# EAGLE design template_50x45 (EAGLE 7.2.0)
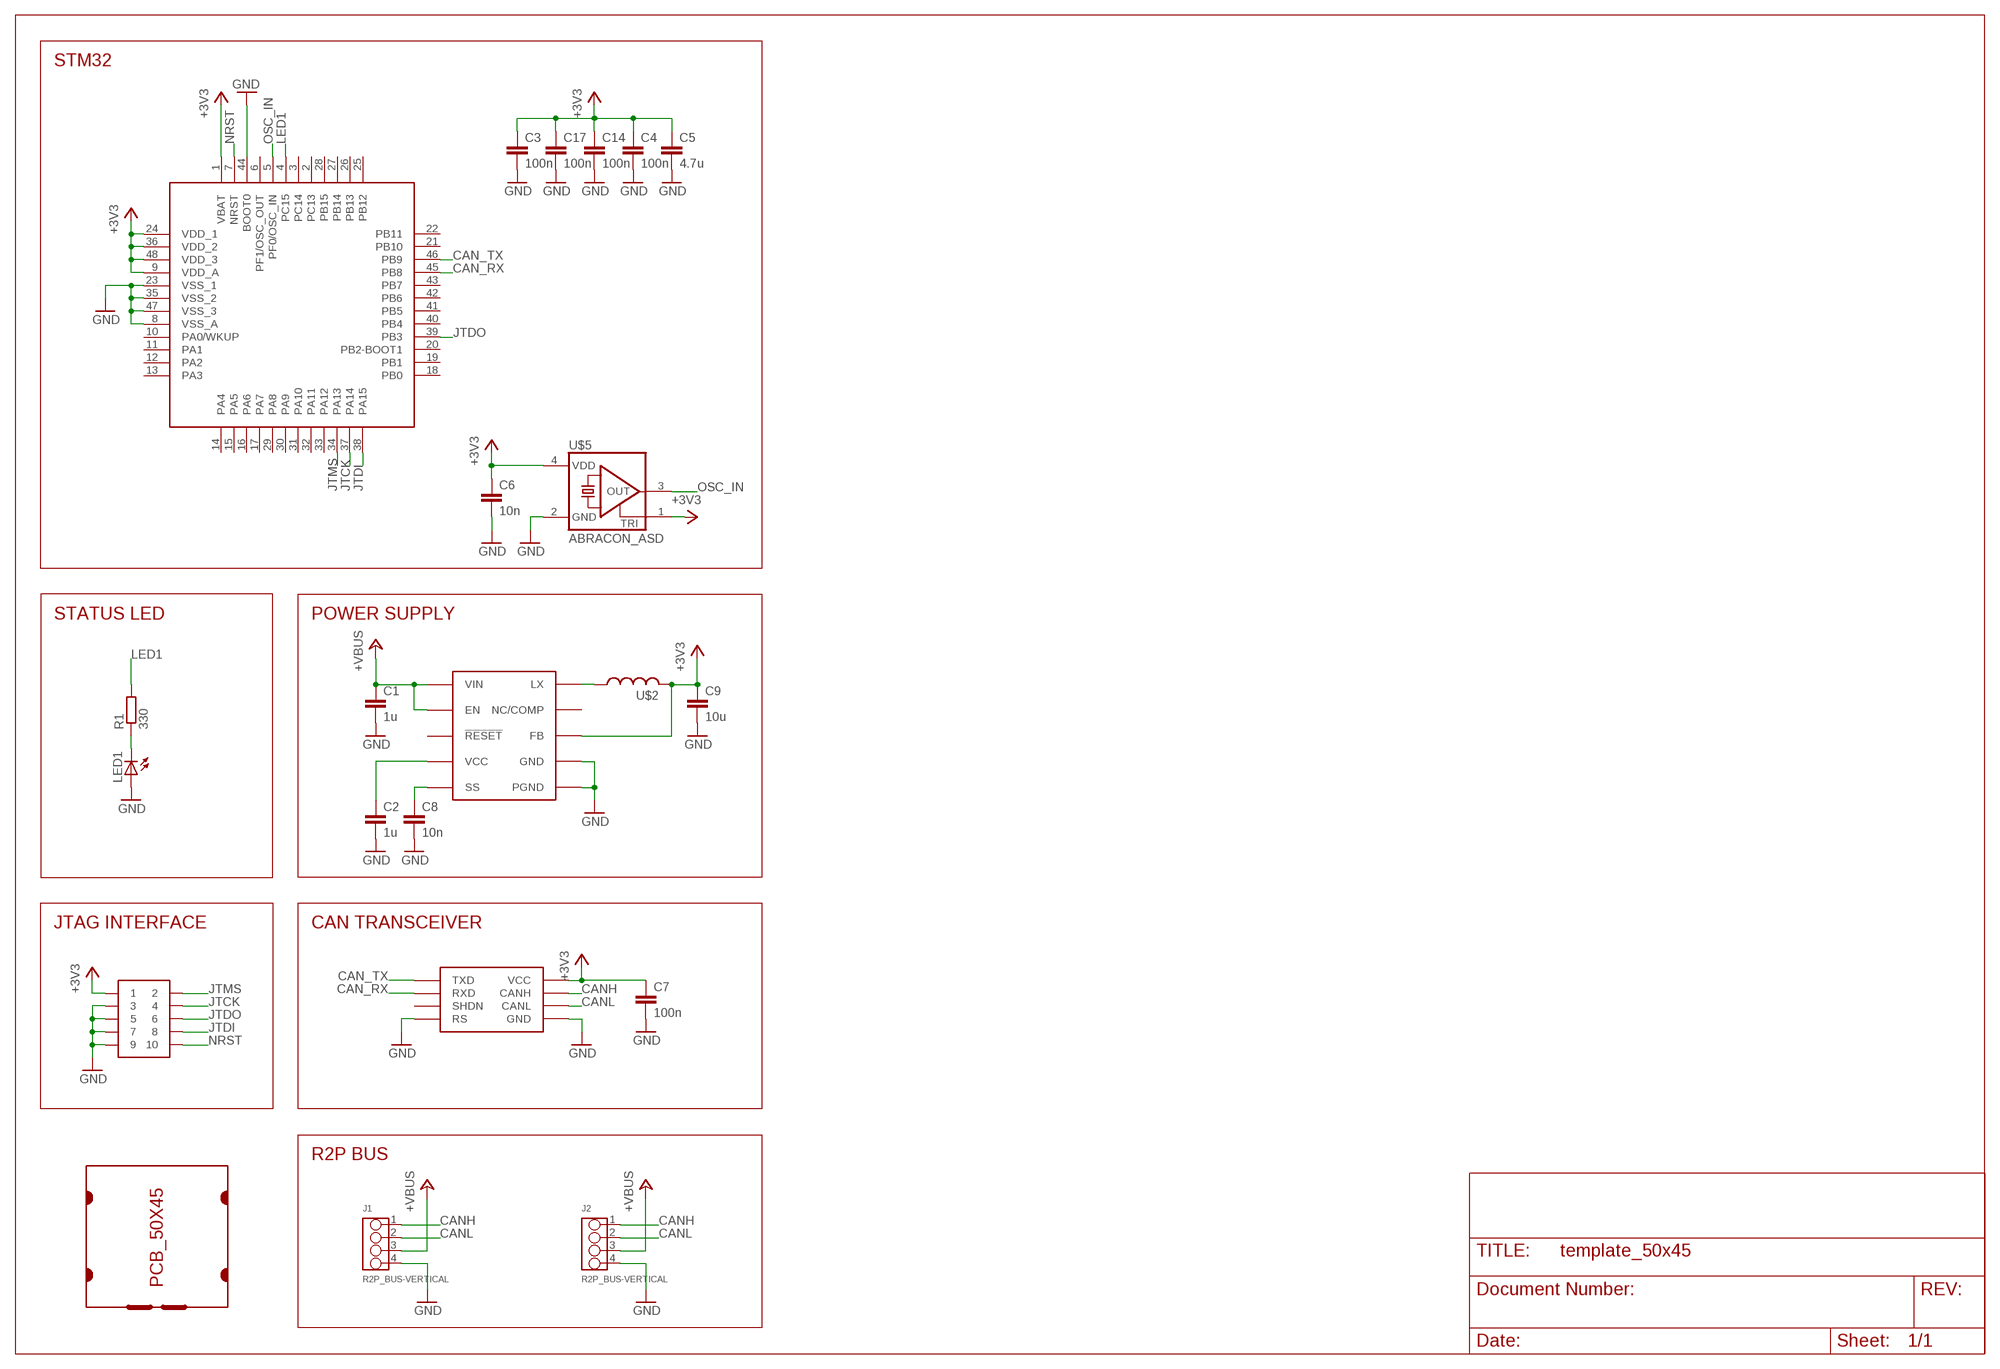
[diagram p0: schematic, sheet 1]

## Parts
C1  1u  C1206  [C1206]
C2  1u  C0603  [C0603]
C3  100n  C0603  [C0603]
C4  100n  C0603  [C0603]
C5  4.7u  C0805  [C0805]
C6  10n  C0603  [C0603]
C7  100n  C0603  [C0603]
C8  10n  C0603  [C0603]
C9  10u  C0805  [C0805]
C14  100n  C0603  [C0603]
C17  100n  C0603  [C0603]
J1  R2P_BUS-VERTICAL  [OPL-EAGLE-LIBRARY_4P-2.0]
J2  R2P_BUS-VERTICAL  [OPL-EAGLE-LIBRARY_4P-2.0]
LED1  LED0805  [CHIPLED_0805]
R1  330  R0603  [R0603]
SOT1  MAX3051EKA  [SOT23-8L]
U$1  PCB_50X45  [50X45]
U$2  LPS4018  [COILCRAFT_LPS4018]
U$3  MAX17501  [TDFN-10]
U$4  JTAG-TH  [SAMTEC_FTSH-105-TH]
U$5  ABRACON_ASD  [ABRACON_2.5X2]
U$6  STM32F303CTX  [LQFP48]

## Nets
+3V3: C3.1 C4.1 C5.1 C6.1 C7.1 C9.1 C14.1 C17.1 SOT1.3(VCC) U$2.P$2 U$3.P$5(FB) U$4.1 U$5.1(TRI) U$5.4(VDD) U$6.1(VBAT) U$6.9(VDD_A) U$6.24(VDD_1) U$6.36(VDD_2) U$6.48(VDD_3)
+VBUS: C1.1 J1.3 J2.3 U$3.P$2(VIN) U$3.P$3(EN)
CAN_RX: SOT1.4(RXD) U$6.45(PB8)
CAN_TX: SOT1.1(TXD) U$6.46(PB9)
CANH: J1.1 J2.1 SOT1.7(CANH)
CANL: J1.2 J2.2 SOT1.6(CANL)
GND: C1.2 C2.2 C3.2 C4.2 C5.2 C6.2 C7.2 C8.2 C9.2 C14.2 C17.2 J1.4 J2.4 LED1.A SOT1.2(GND) SOT1.8(RS) U$3.P$1(PGND) U$3.P$9(GND) U$3.P$11(PGND) U$4.3 U$4.5 U$4.7 U$4.9 U$5.2(GND) U$6.8(VSS_A) U$6.23(VSS_1) U$6.35(VSS_2) U$6.44(BOOT0) U$6.47(VSS_3)
JTCK: U$4.4 U$6.37(PA14)
JTDI: U$4.8 U$6.38(PA15)
JTDO: U$4.6 U$6.39(PB3)
JTMS: U$4.2 U$6.34(PA13)
LED1: R1.2 U$6.4(PC15)
N$1: U$2.P$1 U$3.P$10(LX)
N$4: LED1.C R1.1
N$7: C2.1 U$3.P$4(VCC)
N$8: C8.1 U$3.P$6(SS)
NRST: U$4.10 U$6.7(NRST)
OSC_IN: U$5.3(OUT) U$6.5(PF0/OSC_IN)
Unconnected: SOT1.5(SHDN) U$3.P$7(NC/COMP) U$3.P$8(!RESET) U$6.2(PC13) U$6.3(PC14) U$6.6(PF1/OSC_OUT) U$6.10(PA0/WKUP) U$6.11(PA1) U$6.12(PA2) U$6.13(PA3) U$6.14(PA4) U$6.15(PA5) U$6.16(PA6) U$6.17(PA7) U$6.18(PB0) U$6.19(PB1) U$6.20(PB2-BOOT1) U$6.21(PB10) U$6.22(PB11) U$6.25(PB12) U$6.26(PB13) U$6.27(PB14) U$6.28(PB15) U$6.29(PA8) U$6.30(PA9) U$6.31(PA10) U$6.32(PA11) U$6.33(PA12) U$6.40(PB4) U$6.41(PB5) U$6.42(PB6) U$6.43(PB7)

## Notes on the sheet
- STM32
- STATUS LED | POWER SUPPLY
- JTAG INTERFACE | CAN TRANSCEIVER
- R2P BUS

## Library data of the parts
C1-C9 C14 C17 = r2p_rcl:C
J1 J2 = r2p_connector:R2P_BUS
LED1 = r2p_led:LED
R1 = r2p_rcl:R
SOT1 = r2p_ic:MAX3051
U$1 = r2p_pcb:PCB_50X45
U$2 = r2p_rcl:LPS4018
U$3 = r2p_ic:MAX17501
U$4 = r2p_connector:JTAG
U$5 = r2p_ic:ABRACON_ASD
U$6 = r2p_ic:STM32F303C

## Board
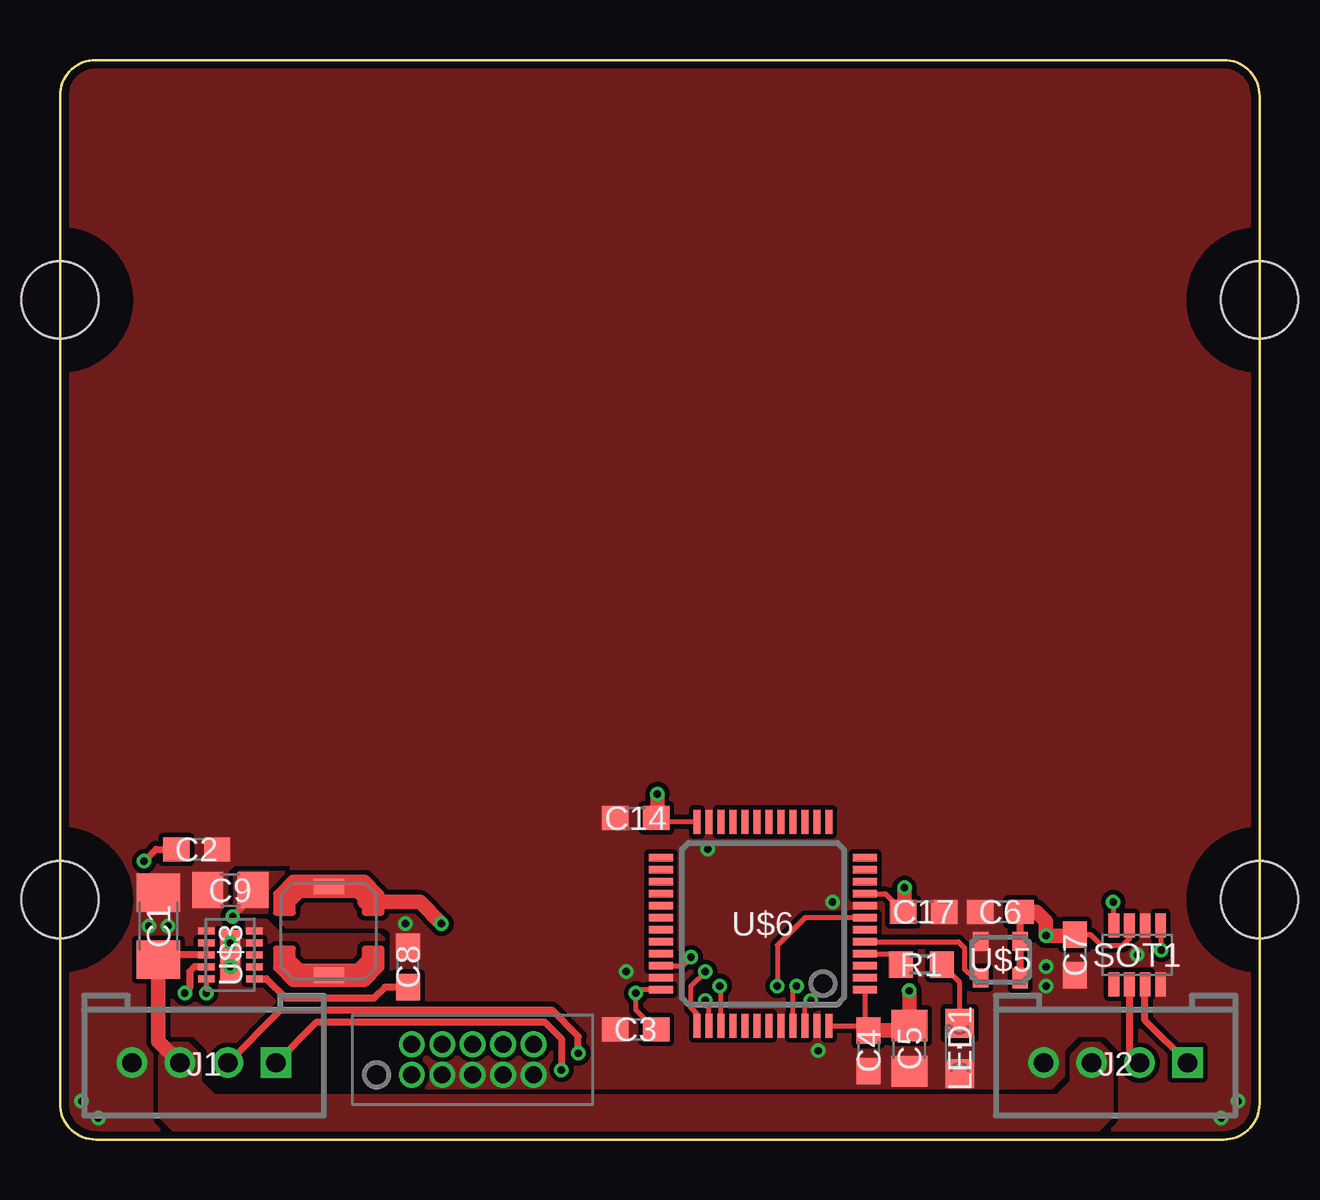
[diagram p1: board, top side]
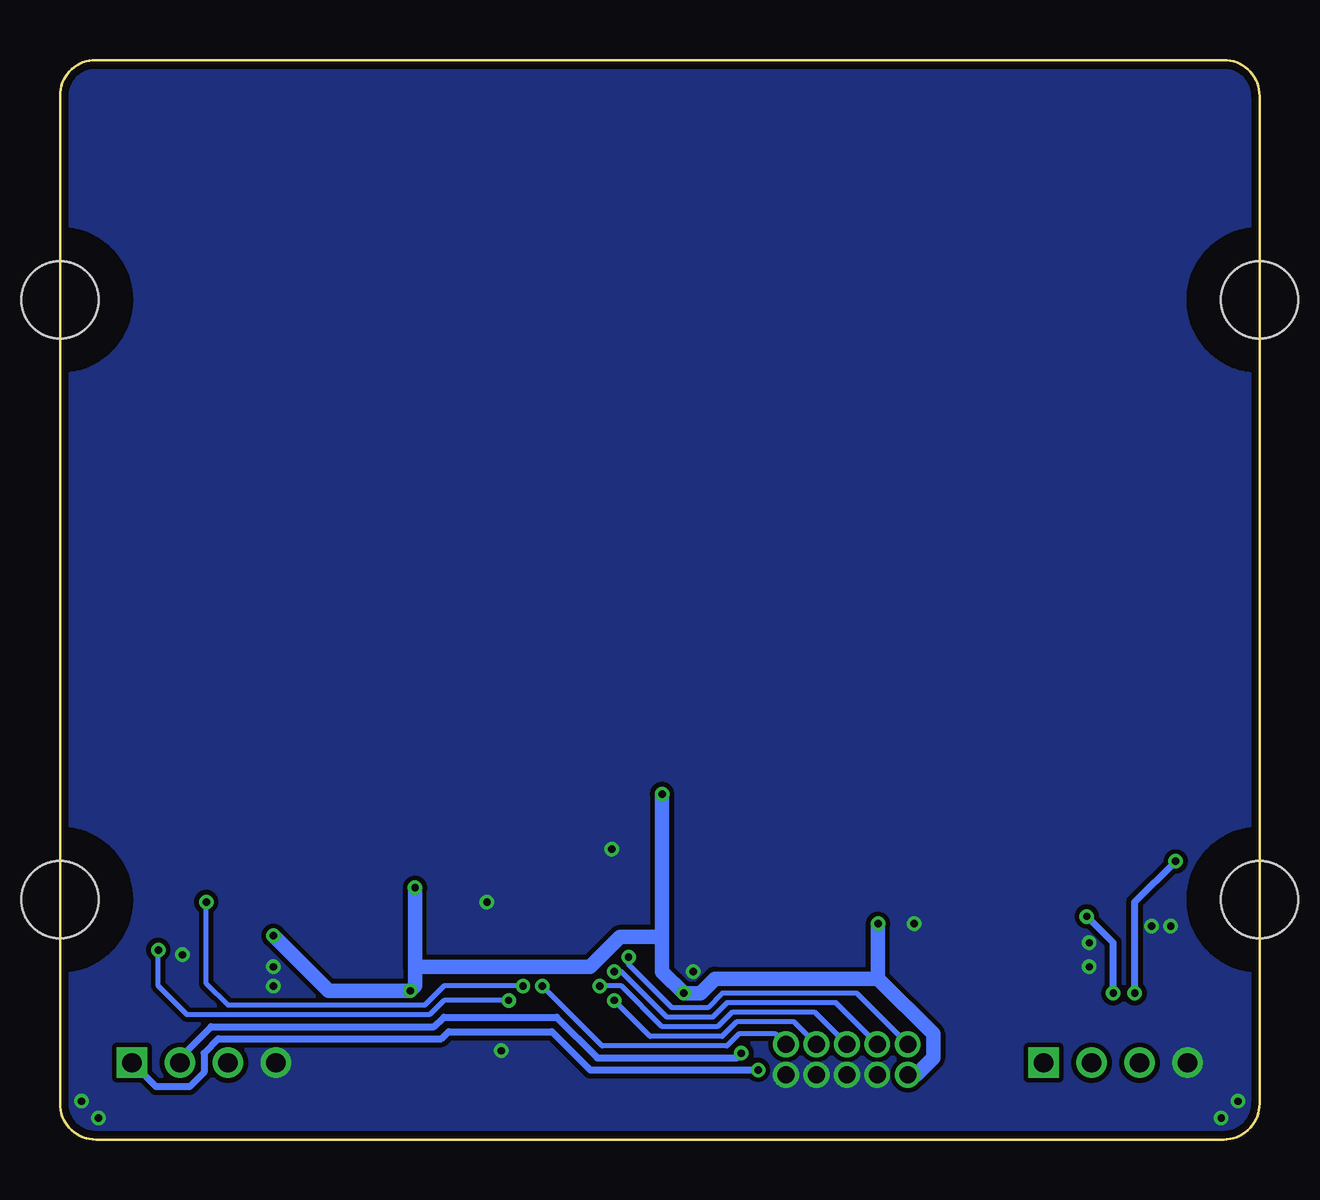
[diagram p2: board, bottom side, seen from below]

Size 50 x 45 mm. Coordinates in mm from the lower left corner, seen from the top.
Copper layers (1*16): Top 0.035mm / dielectric 1.5mm / Bottom 0.035mm
Design rules "2layer_0.2mm": minimum track width 0.2mm, minimum drill 0.3mm, track to track 0.2mm, track to pad 0.2mm, pad to pad 0.2mm, via to via 0.2mm, smd to smd 0mil, copper to edge 0.3mm, drill to drill 0.3mm, minimum pad ring 0.15mm, minimum via ring 0.15mm, stop-mask expansion 0.05mm, vias tented up to drill 2.5mm, thermal gap 0.25mm
tRestrict: 2 lines

### Footprints (pad centres in the part's own frame; a part is rotated, then mirrored left to right if it is on the bottom)
C1206 = smd 1.6 x 1.8: 1 -1.4,0; 2 1.4,0
C0603 = smd 1.1 x 1: 1 -0.85,0; 2 0.85,0
C0805 = smd 1.3 x 1.5: 1 -0.95,0; 2 0.95,0
OPL-EAGLE-LIBRARY_4P-2.0 = drill 0.8 pad 1.27 square: 1 -3,0 | drill 0.8 pad 1.27: 2 -1,0; 3 1,0; 4 3,0
CHIPLED_0805 = smd 1.2 x 1.2: A 0,-1.05; C 0,1.05
R0603 = smd 1 x 1.1: 1 -0.85,0; 2 0.85,0
SOT23-8L = smd 0.45 x 1: 1 -0.975,-1.225; 2 -0.325,-1.225; 3 0.325,-1.225; 4 0.975,-1.225; 5 0.975,1.225; 6 0.325,1.225; 7 -0.325,1.225; 8 -0.975,1.225
50X45 = hole 3.2: 0,10; 50,10; 0,35; 50,35
COILCRAFT_LPS4018 = smd 0.635 x 1.27: P$1 -1.85,0; P$2 1.85,0
TDFN-10 = smd 0.7 x 0.3: P$1 -1,1; P$2 -1,0.5; P$3 -1,0; P$4 -1,-0.5; P$5 -1,-1; P$6 1,-1; P$7 1,-0.5; P$8 1,0; P$9 1,0.5; P$10 1,1 | smd 0.8 x 2.08: P$11 0,0
SAMTEC_FTSH-105-TH = drill 0.711 pad 1.016: 1 -2.54,0; 2 -2.54,1.27; 3 -1.27,0; 4 -1.27,1.27; 5 0,0; 6 0,1.27; 7 1.27,0; 8 1.27,1.27; 9 2.54,0; 10 2.54,1.27
ABRACON_2.5X2 = smd 0.65 x 0.8: 1 -0.825,-0.762; 2 0.825,-0.762; 3 0.825,0.762 | smd 0.65 x 0.85: 4 -0.825,0.762
LQFP48 = smd 1 x 0.3: 1 -4.25,2.75; 2 -4.25,2.25; 3 -4.25,1.75; 4 -4.25,1.25; 5 -4.25,0.75; 6 -4.25,0.25; 7 -4.25,-0.25; 8 -4.25,-0.75; 9 -4.25,-1.25; 10 -4.25,-1.75; 11 -4.25,-2.25; 12 -4.25,-2.75; 25 4.25,-2.75; 26 4.25,-2.25; 27 4.25,-1.75; 28 4.25,-1.25; 29 4.25,-0.75; 30 4.25,-0.25; 31 4.25,0.25; 32 4.25,0.75; 33 4.25,1.25; 34 4.25,1.75; 35 4.25,2.25; 36 4.25,2.75 | smd 0.3 x 1: 13 -2.75,-4.25; 14 -2.25,-4.25; 15 -1.75,-4.25; 16 -1.25,-4.25; 17 -0.75,-4.25; 18 -0.25,-4.25; 19 0.25,-4.25; 20 0.75,-4.25; 21 1.25,-4.25; 22 1.75,-4.25; 23 2.25,-4.25; 24 2.75,-4.25; 37 2.75,4.25; 38 2.25,4.25; 39 1.75,4.25; 40 1.25,4.25; 41 0.75,4.25; 42 0.25,4.25; 43 -0.25,4.25; 44 -0.75,4.25; 45 -1.25,4.25; 46 -1.75,4.25; 47 -2.25,4.25; 48 -2.75,4.25

### Placement (x,y rotation side)
C1  4.1,8.9 90 top
C2  5.7,12.1 0 top
C3  24,4.6 180 top
C4  33.7,3.7 270 top
C5  35.4,3.8 270 top
C6  39.2,9.5 180 top
C7  42.3,7.7 270 top
C8  14.5,7.2 90 top
C9  7.1,10.4 180 top
C14  24,13.4 180 top
C17  36,9.5 0 top
J1  6,3.2 180 top
J2  44,3.2 180 top
LED1  37.5,3.8 0 top
R1  35.9,7.3 180 top
SOT1  44.9,7.7 180 top
U$1  0,0 0 top
U$2  11.2,8.7 90 top
U$3  7.1,7.7 0 top
U$4  17.2,2.7 0 top
U$5  39.2,7.5 180 top
U$6  29.3,9 180 top

### Tracks (layer width: path | path; a pad name or v marks a point on that pad's centre or on a via)
+3V3  (via drill 0.3)
  Top 0.2: U$3.P$5 v6.1,6.1 | C7.1 42.95,8.55 43.4,8.1 44.3,8.1 44.58,8.38 SOT1.3 | 33.5,4.75 C4.1 | U$6.1 33.55,4.7 C4.1 | 24.9,13.35 25,13.25 U$6.24 | U$6.48 33.7,4.75 C4.1 | 24.85,13.25 C14.1 | U$6.9 34.4,10.25 C17.1 | 24.8,4.6 24,5.4 v24,6.1 24.15,6.25 U$6.36
  Top 0.3: 8.05,10.55 8.05,10.75 7.95,10.75 | v7.2,9.3 8.05,10.15 C9.1 | U$5.4 U$5.1 40.02,9.47 C6.1
  Top 0.6: C4.1 35.2,4.55 C5.1 v35.4,6.2 | 24.9,13.35 C14.1 | 8.2,10.55 C9.1 | C6.1 40.7,9.5 41.1,9.1 v41.1,8.5 42.25,8.5 C7.1 | v35.2,10.5 35.2,9.55 C17.1 | 24.85,13.25 24.9,13.3 v24.9,14.4 | C3.1 24.8,4.6 | v15.9,9 15,9.9 12.7,9.9
  Bottom 0.3: v6.1,6.1 6.1,8.2 v7.2,9.3
  Bottom 0.6: v41.1,8.5 38.8,6.2 v35.4,6.2 35.2,6.4 35.2,7.2 | 35.2,7.2 v35.2,10.5 | v24.9,14.4 24.9,8.44 | 24.9,8.44 24.9,7 v24,6.1 23.3,6.1 22.7,6.7 15.9,6.7 | U$4.1 14.3,2.7 13.6,3.4 13.6,4.4 15.9,6.7 | 15.9,6.7 v15.9,9 | 24.9,8.44 26.66,8.44 27.9,7.2 35.2,7.2
  pour Top (rank 5, no thermals): 13.3,8.9 13.5,9.1 13.5,10.3 12.8,11 9.5,11 9.4,11.1 7.5,11.1 7.3,10.9 7.3,9.8 8.3,8.9
+VBUS
  Top 0.2: U$3.P$3 U$3.P$2
  Top 0.3: U$3.P$3 4.3,7.7 C1.1
  Top 0.6: C1.1 4.1,4.1 J1.3
  pour Top (no thermals): 4.7,4 5.3,4 5.8,3.5 5.8,2.4 6.4,1.8 41.6,1.8 42.2,2.4 42.2,3.5 42.7,4 43.3,4 43.8,3.5 43.8,1 42.8,0 5.2,0 4.2,1 4.2,3.5
CAN_RX  (via drill 0.3, 0.3 pad 0.6)
  Top 0.2: U$6.45 30.55,6.25 v30.7,6.4 | SOT1.4 43.92,9.88 v43.9,9.9
  Bottom 0.2: v43.9,9.9 43.9,6.5 43,5.6 34.8,5.6 34,6.4 v30.7,6.4
CAN_TX  (via drill 0.3, 0.3 pad 0.6)
  Top 0.2: SOT1.1 45.88,7.92 v45.9,7.9 | U$6.46 31.05,5.55 v31.3,5.8
  Bottom 0.2: v31.3,5.8 34,5.8 34.6,5.2 44.7,5.2 45.9,6.4 v45.9,7.9
CANH  (via drill 0.3)
  Top 0.3: J2.1 45.23,4.97 SOT1.7 | J1.1 10.7,4.9 20.2,4.9 20.9,4.2 v20.9,2.9
  Bottom 0.3: J2.1 46,2.2 44.6,2.2 44,2.8 44,3.6 43.4,4.2 34.1,4.2 33.8,4.5 29.5,4.5 27.9,2.9 v20.9,2.9
CANL  (via drill 0.3 pad 0.61)
  Top 0.3: SOT1.6 44.58,3.62 J2.2 | J1.2 9.2,5.4 20.5,5.4 21.6,4.3 v21.6,3.6
  Bottom 0.3: J2.2 45,3.4 43.7,4.7 34.4,4.7 34,5.1 29.3,5.1 27.6,3.4 21.8,3.4 v21.6,3.6
GND  (via drill 0.3)
  other vias: 7.1,8.2 7.1,7.2 4.5,8.9 3.7,8.9 41.1,6.4 41.1,7.2 44.9,7.7 49.1,1.6 48.4,0.9 1.6,0.9 0.9,1.6 32.2,9.9 14.4,9 23.6,7 27,12.1 31.6,3.7
  pour Bottom (no thermals): 0,0 50,0 50,45 0,45
  pour Top (rank 6, no thermals): 0,0 50,0 50,45 0,45
JTCK  (via drill 0.3)
  Top 0.2: U$6.37 26.55,5.25 26.3,5.5 26.3,6.4 v26.9,7
  Bottom 0.2: U$4.4 17.66,5.7 22.2,5.7 22.8,5.1 24.7,5.1 26.6,7 v26.9,7
JTDI  (via drill 0.3)
  Top 0.2: U$6.38 27.05,5.65 v26.9,5.8
  Bottom 0.2: 26.7,5.6 v26.9,5.8 25.4,4.3 22.4,4.3 21.8,4.9 19.4,4.9 U$4.8
JTDO  (via drill 0.3)
  Top 0.2: U$6.39 27.55,6.35 v27.5,6.4
  Bottom 0.2: v27.5,6.4 26.6,6.4 24.9,4.7 22.6,4.7 22,5.3 18.53,5.3 U$4.6
JTMS  (via drill 0.3)
  Top 0.2: U$6.34 25.95,7.25 v26.3,7.6
  Bottom 0.2: U$4.2 16.79,6.1 22.4,6.1 23,5.5 24.5,5.5 26.3,7.3 v26.3,7.6
LED1
  Top 0.2: U$6.4 34.6,7.75 R1.2
N$1
  pour Top (no thermals): 7.8,8.7 8.2,8.7 8.5,8.2 8.5,7.5 9.6,6.4 12.8,6.4 13.5,7.1 13.5,8.3 13.3,8.5 9.2,8.5 8.6,9.1 7.8,9.1
N$4
  Top 0.2: LED1.C 37.5,6.55 R1.1
N$7  (via drill 0.3)
  Top 0.3: U$3.P$4 5.6,7.2 5.4,7 5.4,6.3 v5.2,6.1 | v3.5,11.6 4,12.1 C2.1
  Bottom 0.3: v5.2,6.1 5.2,9.9 v3.5,11.6
N$8
  Top 0.3: U$3.P$6 8.6,6.7 9.4,5.9 13.1,5.9 13.55,6.35 C8.1
NRST  (via drill 0.3)
  Top 0.2: U$6.7 31.05,9.25 29.9,8.1 v29.9,6.4
  Bottom 0.2: U$4.10 20.17,4.4 21.7,4.4 22.2,3.9 27.4,3.9 v29.9,6.4
OSC_IN
  Top 0.2: U$6.5 37.45,8.25 37.7,8 37.7,7.1 38.06,6.74 U$5.3